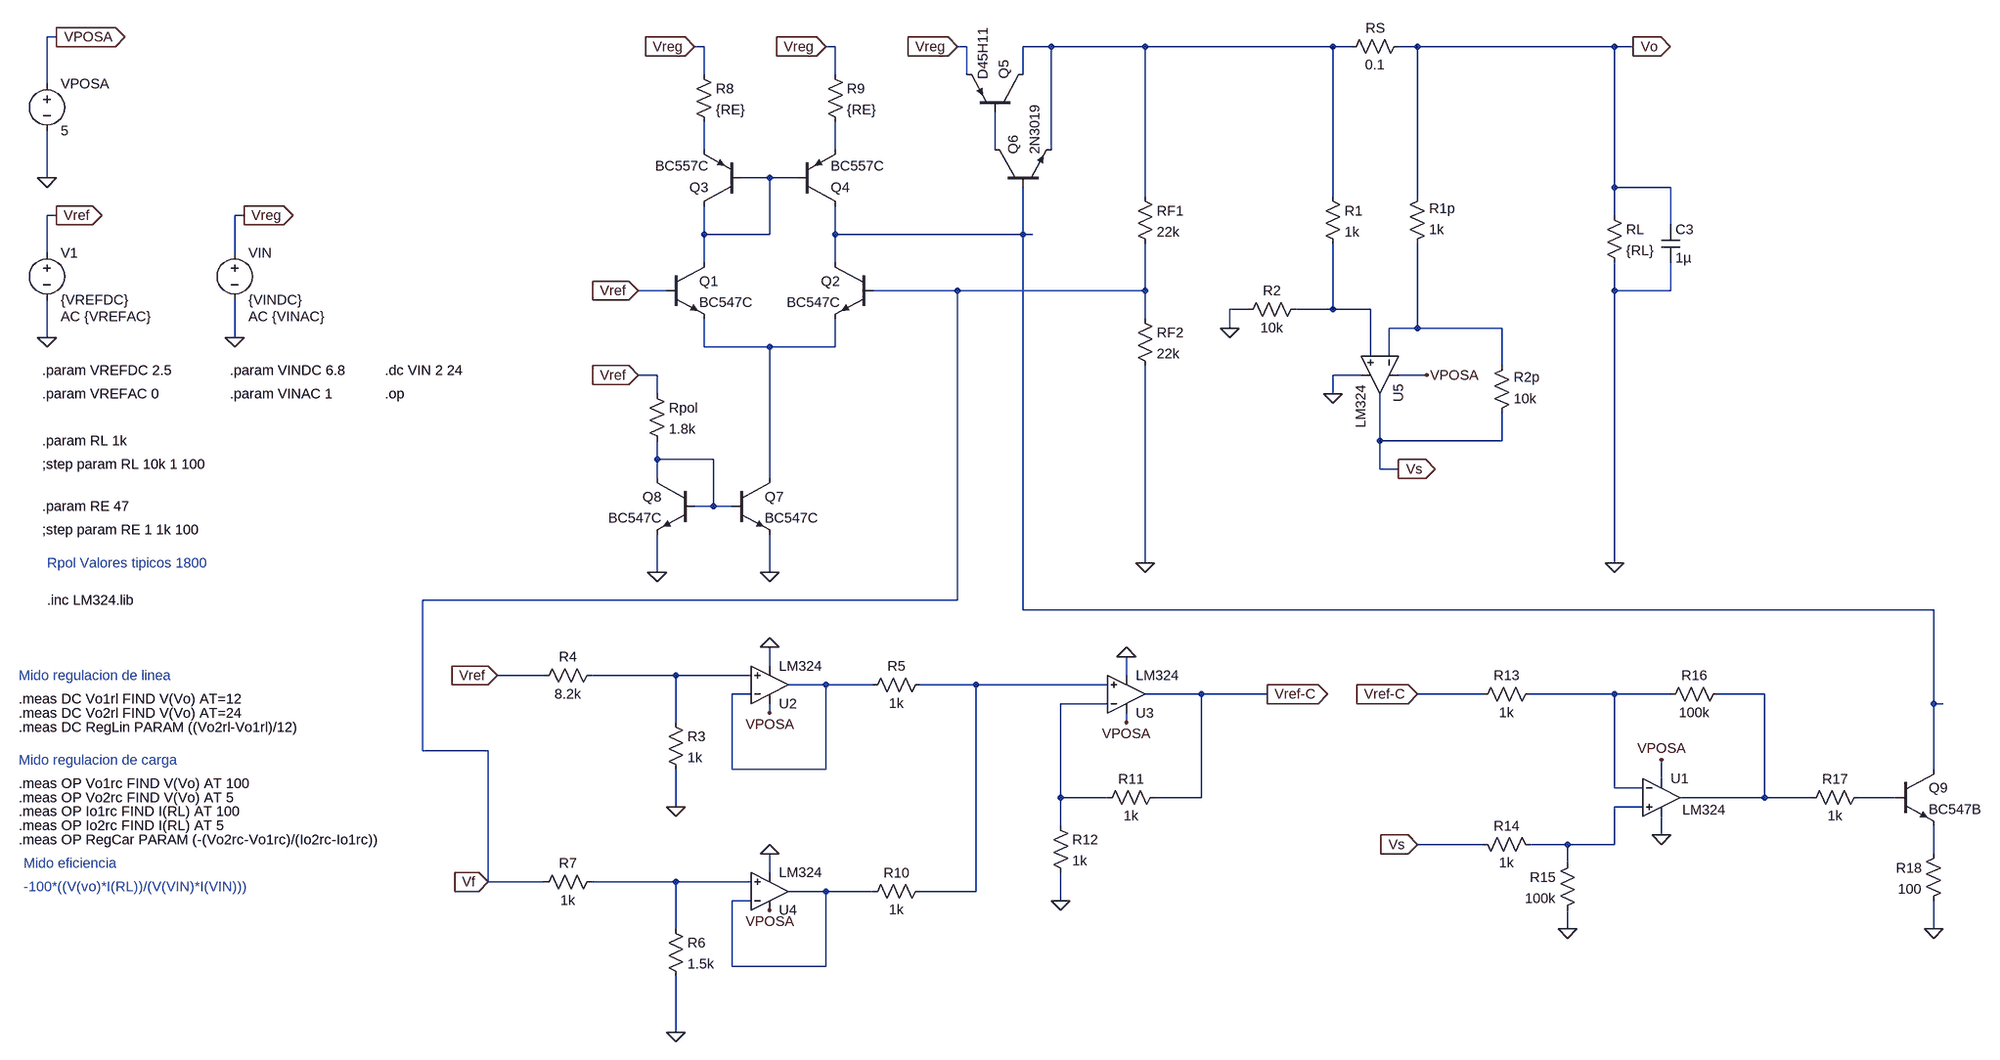
[diagram p0: schematic Version 3.asc]
Version 3.asc, the LTspice schematic file:
Version 4
SHEET 1 3148 2132
WIRE -1008 -144 -1024 -144
WIRE 96 -128 80 -128
WIRE 320 -128 304 -128
WIRE 544 -128 528 -128
WIRE 688 -128 640 -128
WIRE 848 -128 688 -128
WIRE 1168 -128 848 -128
WIRE 1200 -128 1168 -128
WIRE 1312 -128 1280 -128
WIRE 1648 -128 1312 -128
WIRE 1680 -128 1648 -128
WIRE 96 -80 96 -128
WIRE 320 -80 320 -128
WIRE 544 -80 544 -128
WIRE 640 -80 640 -128
WIRE -1024 -64 -1024 -144
WIRE 96 48 96 0
WIRE 320 48 320 0
WIRE 592 48 592 -16
WIRE 688 48 688 -128
WIRE -1024 96 -1024 16
WIRE 208 96 160 96
WIRE 256 96 208 96
WIRE 1648 112 1648 -128
WIRE 1744 112 1648 112
WIRE 848 128 848 -128
WIRE 1168 128 1168 -128
WIRE 1312 128 1312 -128
WIRE -1008 160 -1024 160
WIRE -688 160 -704 160
WIRE 1648 160 1648 112
WIRE 1744 176 1744 112
WIRE 96 192 96 144
WIRE 208 192 208 96
WIRE 208 192 96 192
WIRE 320 192 320 144
WIRE 640 192 640 112
WIRE 640 192 320 192
WIRE 656 192 640 192
WIRE -1024 224 -1024 160
WIRE -704 224 -704 160
WIRE 96 240 96 192
WIRE 320 240 320 192
WIRE 32 288 -16 288
WIRE 528 288 384 288
WIRE 848 288 848 208
WIRE 848 288 528 288
WIRE 1648 288 1648 240
WIRE 1744 288 1744 240
WIRE 1744 288 1648 288
WIRE 1024 320 992 320
WIRE 1168 320 1168 208
WIRE 1168 320 1104 320
WIRE 1232 320 1168 320
WIRE 848 336 848 288
WIRE 992 352 992 320
WIRE 1312 352 1312 208
WIRE 1312 352 1264 352
WIRE 1456 352 1312 352
WIRE -1024 368 -1024 304
WIRE -704 368 -704 304
WIRE 96 384 96 336
WIRE 208 384 96 384
WIRE 320 384 320 336
WIRE 320 384 208 384
WIRE 1232 400 1232 320
WIRE 1264 400 1264 352
WIRE 1456 416 1456 352
WIRE 16 432 -16 432
WIRE 1216 432 1168 432
WIRE 1328 432 1280 432
WIRE 16 464 16 432
WIRE 1168 464 1168 432
WIRE 1248 544 1248 464
WIRE 1456 544 1456 496
WIRE 1456 544 1248 544
WIRE 16 576 16 544
WIRE 112 576 16 576
WIRE 1248 592 1248 544
WIRE 1280 592 1248 592
WIRE 16 608 16 576
WIRE 208 608 208 384
WIRE 112 656 112 576
WIRE 112 656 80 656
WIRE 144 656 112 656
WIRE 848 752 848 416
WIRE 1648 752 1648 288
WIRE 16 768 16 704
WIRE 208 768 208 704
WIRE 528 816 528 288
WIRE 528 816 -384 816
WIRE 640 832 640 192
WIRE 2192 832 640 832
WIRE 208 928 208 896
WIRE -176 944 -256 944
WIRE 48 944 -96 944
WIRE 176 944 48 944
WIRE 816 944 816 912
WIRE 304 960 240 960
WIRE 384 960 304 960
WIRE 560 960 464 960
WIRE 784 960 560 960
WIRE 176 976 144 976
WIRE 944 976 848 976
WIRE 1056 976 944 976
WIRE 1424 976 1312 976
WIRE 1648 976 1504 976
WIRE 1744 976 1648 976
WIRE 1904 976 1824 976
WIRE 784 992 704 992
WIRE 2192 992 2192 832
WIRE 2208 992 2192 992
WIRE 208 1008 208 992
WIRE 48 1024 48 944
WIRE 816 1024 816 1008
WIRE -384 1072 -384 816
WIRE -272 1072 -384 1072
WIRE 144 1104 144 976
WIRE 304 1104 304 960
WIRE 304 1104 144 1104
WIRE 2192 1104 2192 992
WIRE 1728 1120 1728 1088
WIRE 1648 1136 1648 976
WIRE 1696 1136 1648 1136
WIRE 704 1152 704 992
WIRE 784 1152 704 1152
WIRE 944 1152 944 976
WIRE 944 1152 864 1152
WIRE 1904 1152 1904 976
WIRE 1904 1152 1760 1152
WIRE 1984 1152 1904 1152
WIRE 2128 1152 2064 1152
WIRE 48 1168 48 1104
WIRE 1696 1168 1648 1168
WIRE 704 1200 704 1152
WIRE 1728 1216 1728 1184
WIRE 1424 1232 1312 1232
WIRE 1568 1232 1504 1232
WIRE 1648 1232 1648 1168
WIRE 1648 1232 1568 1232
WIRE 2192 1248 2192 1200
WIRE 1568 1264 1568 1232
WIRE 208 1280 208 1248
WIRE -272 1296 -272 1072
WIRE -176 1296 -272 1296
WIRE 48 1296 -96 1296
WIRE 176 1296 48 1296
WIRE 304 1312 240 1312
WIRE 384 1312 304 1312
WIRE 560 1312 560 960
WIRE 560 1312 464 1312
WIRE 176 1328 144 1328
WIRE 704 1328 704 1280
WIRE 48 1376 48 1296
WIRE 1568 1376 1568 1344
WIRE 2192 1376 2192 1328
WIRE 144 1440 144 1328
WIRE 304 1440 304 1312
WIRE 304 1440 144 1440
WIRE 48 1552 48 1456
FLAG 1680 -128 Vo
IOPIN 1680 -128 Out
FLAG -1008 160 Vref
IOPIN -1008 160 Out
FLAG -1024 368 0
FLAG -688 160 Vreg
IOPIN -688 160 Out
FLAG 1648 752 0
FLAG 848 752 0
FLAG -16 288 Vref
IOPIN -16 288 In
FLAG -16 432 Vref
IOPIN -16 432 In
FLAG -704 368 0
FLAG 16 768 0
FLAG 208 768 0
FLAG 80 -128 Vreg
IOPIN 80 -128 In
FLAG 304 -128 Vreg
IOPIN 304 -128 In
FLAG 528 -128 Vreg
IOPIN 528 -128 In
FLAG 1568 1376 0
FLAG 2192 1376 0
FLAG 48 1168 0
FLAG 48 1552 0
FLAG 704 1328 0
FLAG 208 1008 VPOSA
FLAG 816 1024 VPOSA
FLAG 1728 1088 VPOSA
FLAG 208 1344 VPOSA
FLAG 208 1248 0
FLAG 208 896 0
FLAG 816 912 0
FLAG 1728 1216 0
FLAG -272 1296 Vf
IOPIN -272 1296 In
FLAG -256 944 Vref
IOPIN -256 944 In
FLAG 1312 976 Vref-C
IOPIN 1312 976 In
FLAG 1312 1232 Vs
IOPIN 1312 1232 In
FLAG 1056 976 Vref-C
IOPIN 1056 976 Out
FLAG 1328 432 VPOSA
FLAG 992 352 0
FLAG 1168 464 0
FLAG 1280 592 Vs
IOPIN 1280 592 Out
FLAG -1024 96 0
FLAG -1008 -144 VPOSA
IOPIN -1008 -144 Out
DATAFLAG 512 288 ""
DATAFLAG 16 288 ""
DATAFLAG 368 192 ""
DATAFLAG 112 192 ""
DATAFLAG 224 96 ""
DATAFLAG 320 32 ""
SYMBOL pnp 160 144 R180
SYMATTR InstName Q3
SYMATTR Value BC557C
SYMBOL pnp 256 144 M180
SYMATTR InstName Q4
SYMATTR Value BC557C
SYMBOL npn 32 240 R0
SYMATTR InstName Q1
SYMATTR Value BC547C
SYMBOL npn 384 240 M0
SYMATTR InstName Q2
SYMATTR Value BC547C
SYMBOL pnp 640 -16 M270
SYMATTR InstName Q5
SYMATTR Value D45H11
SYMBOL npn 592 112 R270
SYMATTR InstName Q6
SYMATTR Value 2N3019
SYMBOL res 832 112 R0
SYMATTR InstName RF1
SYMATTR Value 22k
SYMBOL res 832 320 R0
SYMATTR InstName RF2
SYMATTR Value 22k
SYMBOL res 1632 144 R0
SYMATTR InstName RL
SYMATTR Value {RL}
SYMBOL voltage -1024 208 R0
WINDOW 123 24 124 Left 2
WINDOW 39 0 0 Left 0
SYMATTR Value2 AC {VREFAC}
SYMATTR InstName V1
SYMATTR Value {VREFDC}
SYMBOL res 80 -96 R0
SYMATTR InstName R8
SYMATTR Value {RE}
SYMBOL res 304 -96 R0
SYMATTR InstName R9
SYMATTR Value {RE}
SYMBOL cap 1728 176 R0
SYMATTR InstName C3
SYMATTR Value 1µ
SYMBOL voltage -704 208 R0
WINDOW 123 24 124 Left 2
WINDOW 39 0 0 Left 0
SYMATTR Value2 AC {VINAC}
SYMATTR InstName VIN
SYMATTR Value {VINDC}
SYMBOL npn 144 608 R0
SYMATTR InstName Q7
SYMATTR Value BC547C
SYMBOL npn 80 608 M0
SYMATTR InstName Q8
SYMATTR Value BC547C
SYMBOL res 0 448 R0
SYMATTR InstName Rpol
SYMATTR Value 1.8k
SYMBOL npn 2128 1104 R0
SYMATTR InstName Q9
SYMATTR Value BC547B
SYMBOL OpAmps\\opamp2 1728 1088 R0
WINDOW 3 36 85 Left 2
SYMATTR Value LM324
SYMATTR InstName U1
SYMBOL OpAmps\\opamp2 208 1024 M180
SYMATTR InstName U2
SYMATTR Value LM324
SYMBOL OpAmps\\opamp2 816 1040 M180
SYMATTR InstName U3
SYMATTR Value LM324
SYMBOL OpAmps\\opamp2 208 1376 M180
SYMATTR InstName U4
SYMATTR Value LM324
SYMBOL res 1296 -144 R90
WINDOW 0 0 56 VBottom 2
WINDOW 3 32 56 VTop 2
SYMATTR InstName RS
SYMATTR Value 0.1
SYMBOL OpAmps\\opamp2 1312 432 R90
SYMATTR InstName U5
SYMATTR Value LM324
SYMBOL voltage -1024 -80 R0
SYMATTR InstName VPOSA
SYMATTR Value 5
SYMBOL res 1152 112 R0
SYMATTR InstName R1
SYMATTR Value 1k
SYMBOL res 1120 304 R90
WINDOW 0 0 56 VBottom 2
WINDOW 3 32 56 VTop 2
SYMATTR InstName R2
SYMATTR Value 10k
SYMBOL res 1296 224 M180
WINDOW 0 36 76 Left 2
WINDOW 3 36 40 Left 2
SYMATTR InstName R1p
SYMATTR Value 1k
SYMBOL res 1440 512 M180
WINDOW 0 36 76 Left 2
WINDOW 3 36 40 Left 2
SYMATTR InstName R2p
SYMATTR Value 10k
SYMBOL res 32 1008 R0
SYMATTR InstName R3
SYMATTR Value 1k
SYMBOL res -80 928 R90
WINDOW 0 0 56 VBottom 2
WINDOW 3 32 56 VTop 2
SYMATTR InstName R4
SYMATTR Value 8.2k
SYMBOL res 480 944 R90
WINDOW 0 0 56 VBottom 2
WINDOW 3 32 56 VTop 2
SYMATTR InstName R5
SYMATTR Value 1k
SYMBOL res 32 1360 R0
SYMATTR InstName R6
SYMATTR Value 1.5k
SYMBOL res -80 1280 R90
WINDOW 0 0 56 VBottom 2
WINDOW 3 32 56 VTop 2
SYMATTR InstName R7
SYMATTR Value 1k
SYMBOL res 480 1296 R90
WINDOW 0 0 56 VBottom 2
WINDOW 3 32 56 VTop 2
SYMATTR InstName R10
SYMATTR Value 1k
SYMBOL res 880 1136 R90
WINDOW 0 0 56 VBottom 2
WINDOW 3 32 56 VTop 2
SYMATTR InstName R11
SYMATTR Value 1k
SYMBOL res 688 1184 R0
SYMATTR InstName R12
SYMATTR Value 1k
SYMBOL res 1408 992 R270
WINDOW 0 32 56 VTop 2
WINDOW 3 0 56 VBottom 2
SYMATTR InstName R13
SYMATTR Value 1k
SYMBOL res 1408 1216 M90
WINDOW 0 0 56 VBottom 2
WINDOW 3 32 56 VTop 2
SYMATTR InstName R14
SYMATTR Value 1k
SYMBOL res 1584 1248 M0
SYMATTR InstName R15
SYMATTR Value 100k
SYMBOL res 1728 992 R270
WINDOW 0 32 56 VTop 2
WINDOW 3 0 56 VBottom 2
SYMATTR InstName R16
SYMATTR Value 100k
SYMBOL res 1968 1168 R270
WINDOW 0 32 56 VTop 2
WINDOW 3 0 56 VBottom 2
SYMATTR InstName R17
SYMATTR Value 1k
SYMBOL res 2208 1232 M0
SYMATTR InstName R18
SYMATTR Value 100
TEXT -448 464 Left 2 !.op
TEXT -712 424 Left 2 !.param VINDC 6.8
TEXT -712 464 Left 2 !.param VINAC 1
TEXT -1032 424 Left 2 !.param VREFDC 2.5
TEXT -1032 464 Left 2 !.param VREFAC 0
TEXT -1032 544 Left 2 !.param RL 1k
TEXT -448 424 Left 2 !.dc VIN 2 24
TEXT -1032 696 Left 2 !;step param RE 1 1k 100
TEXT -1032 656 Left 2 !.param RE 47
TEXT -1032 584 Left 2 !;step param RL 10k 1 100
TEXT -1072 944 Left 2 ;Mido regulacion de linea
TEXT -1072 984 Left 2 !.meas DC Vo1rl FIND V(Vo) AT=12
TEXT -1072 1008 Left 2 !.meas DC Vo2rl FIND V(Vo) AT=24
TEXT -1072 1032 Left 2 !.meas DC RegLin PARAM ((Vo2rl-Vo1rl)/12)
TEXT -1072 1088 Left 2 ;Mido regulacion de carga
TEXT -1072 1128 Left 2 !.meas OP Vo1rc FIND V(Vo) AT 100
TEXT -1072 1152 Left 2 !.meas OP Vo2rc FIND V(Vo) AT 5
TEXT -1072 1176 Left 2 !.meas OP Io1rc FIND I(RL) AT 100
TEXT -1072 1200 Left 2 !.meas OP Io2rc FIND I(RL) AT 5
TEXT -1064 1264 Left 2 ;Mido eficiencia
TEXT -1064 1304 Left 2 ;-100*((V(vo)*I(RL))/(V(VIN)*I(VIN)))
TEXT -1072 1224 Left 2 !.meas OP RegCar PARAM (-(Vo2rc-Vo1rc)/(Io2rc-Io1rc))
TEXT -1024 752 Left 2 ;Rpol Valores tipicos 1800
TEXT -1024 816 Left 2 !.inc LM324.lib

The netlist it stands for:
* Version 3.asc
Q3 N005 N005 N002 0 BC557C
Q4 N006 N005 N003 0 BC557C
Q1 N005 Vref N009 0 BC547C
Q2 N006 Vf N009 0 BC547C
Q5 N001 N004 Vreg 0 D45H11
Q6 N004 N006 N001 0 2N3019
RF1 N001 Vf 22k
RF2 Vf 0 22k
RL Vo 0 {RL}
V1 Vref 0 {VREFDC} AC {VREFAC}
R8 Vreg N002 {RE}
R9 Vreg N003 {RE}
C3 Vo 0 1µ
VIN Vreg 0 {VINDC} AC {VINAC}
Q7 N009 N010 0 0 BC547C
Q8 N010 N010 0 0 BC547C
Rpol Vref N010 1.8k
Q9 N006 N017 N019 0 BC547B
XU1 N018 N014 VPOSA 0 N015 LM324  ; pins In+ In- V+ V- OUT
XU2 N011 N012 VPOSA 0 N012 LM324  ; pins In+ In- V+ V- OUT
XU3 N013 N016 VPOSA 0 Vref-C LM324  ; pins In+ In- V+ V- OUT
XU4 N020 N021 VPOSA 0 N021 LM324  ; pins In+ In- V+ V- OUT
RS Vo N001 0.1
XU5 N007 N008 VPOSA 0 Vs LM324  ; pins In+ In- V+ V- OUT
VPOSA VPOSA 0 5
R1 N001 N007 1k
R2 N007 0 10k
R1p N008 Vo 1k
R2p Vs N008 10k
R3 N011 0 1k
R4 N011 Vref 8.2k
R5 N013 N012 1k
R6 N020 0 1.5k
R7 N020 Vf 1k
R10 N013 N021 1k
R11 Vref-C N016 1k
R12 N016 0 1k
R13 Vref-C N014 1k
R14 Vs N018 1k
R15 N018 0 100k
R16 N014 N015 100k
R17 N015 N017 1k
R18 N019 0 100
.model NPN NPN
.model PNP PNP
.lib standard.bjt
.op
.param VINDC 6.8
.param VINAC 1
.param VREFDC 2.5
.param VREFAC 0
.param RL 1k
.dc VIN 2 24
;step param RE 1 1k 100
.param RE 47
;step param RL 10k 1 100
* Mido regulacion de linea
.meas DC Vo1rl FIND V(Vo) AT=12
.meas DC Vo2rl FIND V(Vo) AT=24
.meas DC RegLin PARAM ((Vo2rl-Vo1rl)/12)
* Mido regulacion de carga
.meas OP Vo1rc FIND V(Vo) AT 100
.meas OP Vo2rc FIND V(Vo) AT 5
.meas OP Io1rc FIND I(RL) AT 100
.meas OP Io2rc FIND I(RL) AT 5
* Mido eficiencia
* -100*((V(vo)*I(RL))/(V(VIN)*I(VIN)))
.meas OP RegCar PARAM (-(Vo2rc-Vo1rc)/(Io2rc-Io1rc))
* Rpol Valores tipicos 1800
.inc LM324.lib
.backanno
.end

* Results of the author's LTspice run, read from the files saved beside the schematic
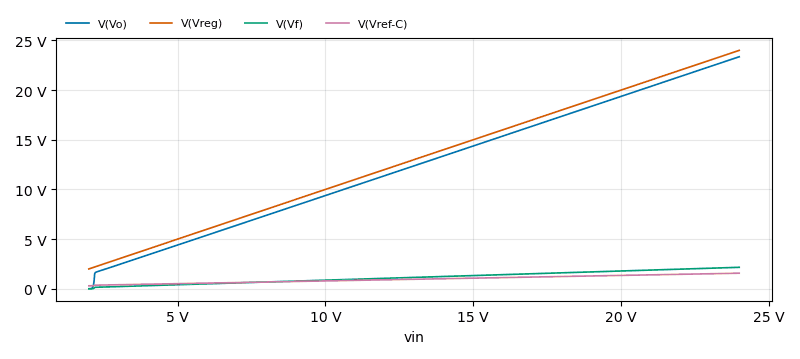
[diagram p1: DC transfer characteristic of Version 3.asc, plotted from the saved traces]
* DC transfer characteristic, 1 run:
*   V(Vo): 6.315 mV at vin=2 V, 23.36 V at vin=24 V, min 6.315 mV, max 23.36 V
*   V(Vreg): 2 V at vin=2 V, 24 V at vin=24 V, min 2 V, max 24 V
*   V(Vf): 618.4 µV at vin=2 V, 2.163 V at vin=24 V, min 618.4 µV, max 2.163 V
*   V(Vref-C): 302.6 mV at vin=2 V, 1.57 V at vin=24 V, min 302.6 mV, max 1.57 V
* From the log:
*   vo1rl: v(vo)=11.3779 at 12
*   vo2rl: v(vo)=23.3579 at 24
*   reglin: ((vo2rl-vo1rl)/12)=0.998329